# Altium schematic sheet pioneer_2-bluepill_eletronic_wrapper.SchDoc
size A; SheetNumber: 1; SheetTotal: 3
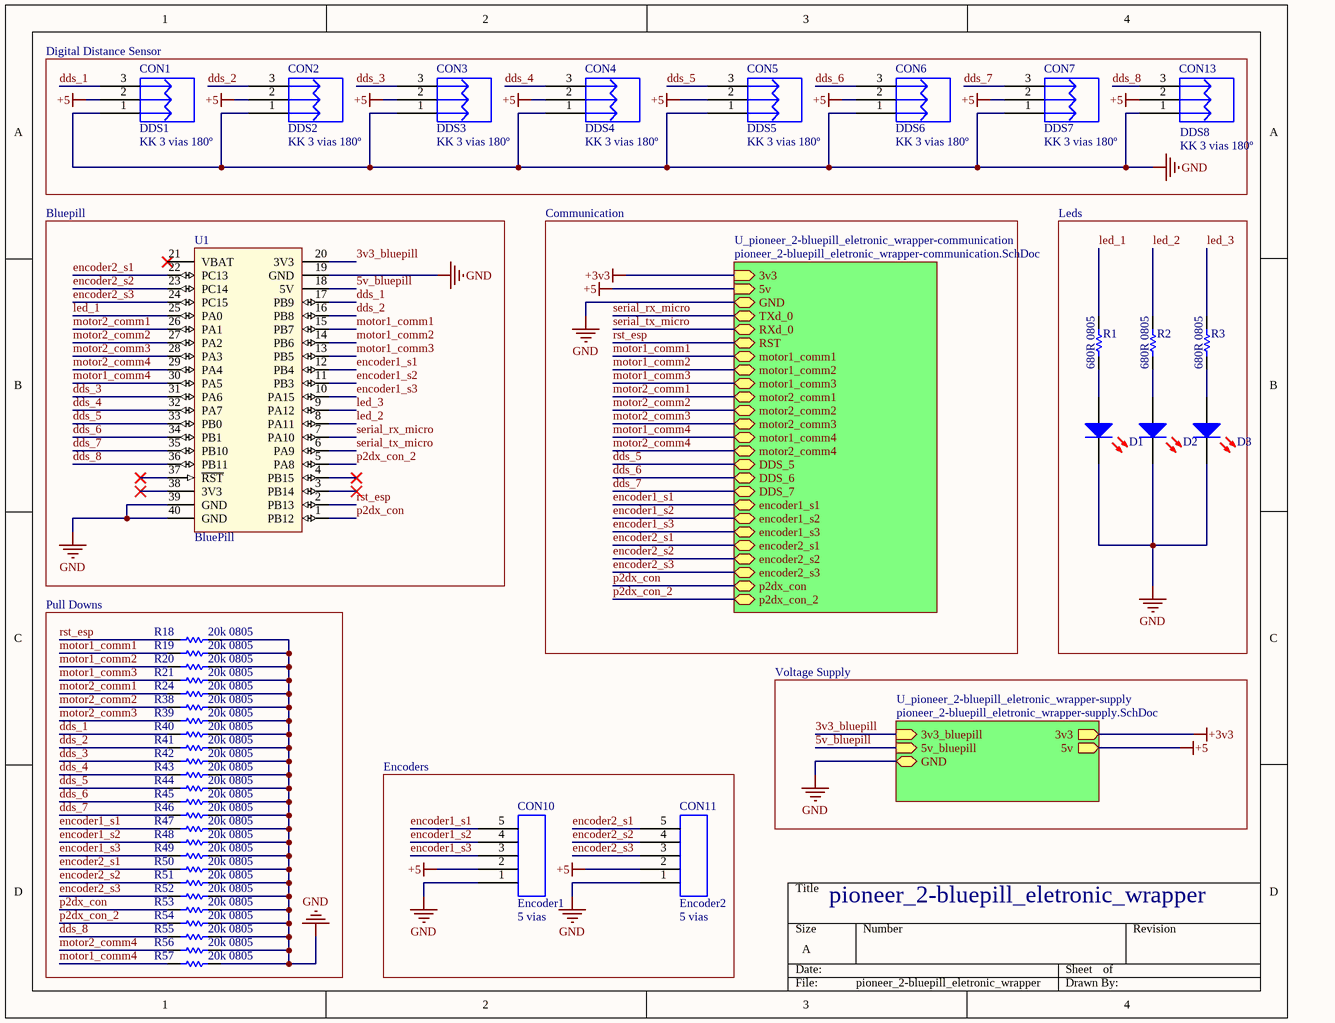
[diagram p0: pioneer_2-bluepill_eletronic_wrapper.SchDoc]

## Parts
CON1  DDS1  Valor: KK 3 vias 180º  [KK_3vias_180º]
CON2  DDS2  Valor: KK 3 vias 180º  [KK_3vias_180º]
CON3  DDS3  Valor: KK 3 vias 180º  [KK_3vias_180º]
CON4  DDS4  Valor: KK 3 vias 180º  [KK_3vias_180º]
CON5  DDS5  Valor: KK 3 vias 180º  [KK_3vias_180º]
CON6  DDS6  Valor: KK 3 vias 180º  [KK_3vias_180º]
CON7  DDS7  Valor: KK 3 vias 180º  [KK_3vias_180º]
CON10  Encoder1  Valor: 5 vias  [5vias]
CON11  Encoder2  Valor: 5 vias  [5vias]
CON13  DDS8  Valor: KK 3 vias 180º  [KK_3vias_180º]
D1  LED 3MM RED  [LED RED]  (value not drawn)
D2  LED 3MM RED  [LED RED]  (value not drawn)
D3  LED 3MM RED  [LED RED]  (value not drawn)
R1  680R 0805  [RESISTOR 0805]
R2  680R 0805  [RESISTOR 0805]
R3  680R 0805  [RESISTOR 0805]
R18  20k 0805  [RESISTOR 0805]
R19  20k 0805  [RESISTOR 0805]
R20  20k 0805  [RESISTOR 0805]
R21  20k 0805  [RESISTOR 0805]
R24  20k 0805  [RESISTOR 0805]
R38  20k 0805  [RESISTOR 0805]
R39  20k 0805  [RESISTOR 0805]
R40  20k 0805  [RESISTOR 0805]
R41  20k 0805  [RESISTOR 0805]
R42  20k 0805  [RESISTOR 0805]
R43  20k 0805  [RESISTOR 0805]
R44  20k 0805  [RESISTOR 0805]
R45  20k 0805  [RESISTOR 0805]
R46  20k 0805  [RESISTOR 0805]
R47  20k 0805  [RESISTOR 0805]
R48  20k 0805  [RESISTOR 0805]
R49  20k 0805  [RESISTOR 0805]
R50  20k 0805  [RESISTOR 0805]
R51  20k 0805  [RESISTOR 0805]
R52  20k 0805  [RESISTOR 0805]
R53  20k 0805  [RESISTOR 0805]
R54  20k 0805  [RESISTOR 0805]
R55  20k 0805  [RESISTOR 0805]
R56  20k 0805  [RESISTOR 0805]
R57  20k 0805  [RESISTOR 0805]
U1  BluePill  [BluePill]

## Blocks framed on the sheet
Digital Distance Sensor: CON1-CON7 CON13
Bluepill: U1
Leds: D1-D3 R1-R3
Pull Downs: R18-R21 R24 R38-R57
Encoders: CON10 CON11

## Sub-sheets
U_pioneer_2-bluepill_eletronic_wrapper-communication = pioneer_2-bluepill_eletronic_wrapper-communication.SchDoc: 3v3 (in), 5v (in), GND (bidir), TXd_0 (bidir), RXd_0 (bidir), RST (bidir), motor1_comm1 (bidir), motor1_comm2 (bidir), motor1_comm3 (bidir), motor2_comm1 (bidir), motor2_comm2 (bidir), motor2_comm3 (bidir), motor1_comm4 (bidir), motor2_comm4 (bidir), DDS_5 (bidir), DDS_6 (bidir), DDS_7 (bidir), encoder1_s1 (bidir), encoder1_s2 (bidir), encoder1_s3 (bidir), encoder2_s1 (bidir), encoder2_s2 (bidir), encoder2_s3 (bidir), p2dx_con (bidir), p2dx_con_2 (bidir)
U_pioneer_2-bluepill_eletronic_wrapper-supply = pioneer_2-bluepill_eletronic_wrapper-supply.SchDoc: 3v3_bluepill (in), 5v_bluepill (in), 3v3 (out), 5v (out), GND (bidir)

## Nets
+3v3: sheet U_pioneer_2-bluepill_eletronic_wrapper-supply/3v3, sheet U_pioneer_2-bluepill_eletronic_wrapper-communication/3v3
+5: CON1.2 CON2.2 CON3.2 CON4.2 CON5.2 CON6.2 CON7.2 CON10.2 CON11.2 CON13.2 ; sheet U_pioneer_2-bluepill_eletronic_wrapper-supply/5v, sheet U_pioneer_2-bluepill_eletronic_wrapper-communication/5v
GND: CON1.1 CON2.1 CON3.1 CON4.1 CON5.1 CON6.1 CON7.1 CON10.1 CON11.1 CON13.1 D1.2(K) D2.2(K) D3.2(K) R18.2 R19.2 R20.2 R21.2 R24.2 R38.2 R39.2 R40.2 R41.2 R42.2 R43.2 R44.2 R45.2 R46.2 R47.2 R48.2 R49.2 R50.2 R51.2 R52.2 R53.2 R54.2 R55.2 R56.2 R57.2 U1.19(GND) U1.39(GND) U1.40(GND) ; sheet U_pioneer_2-bluepill_eletronic_wrapper-supply/GND, sheet U_pioneer_2-bluepill_eletronic_wrapper-communication/GND
3v3_bluepill: U1.20(3V3) ; sheet U_pioneer_2-bluepill_eletronic_wrapper-supply/3v3_bluepill
5v_bluepill: U1.18(5V) ; sheet U_pioneer_2-bluepill_eletronic_wrapper-supply/5v_bluepill
dds_1: CON1.3 R40.1 U1.17(PB9)
dds_2: CON2.3 R41.1 U1.16(PB8)
dds_3: CON3.3 R42.1 U1.31(PA6)
dds_4: CON4.3 R43.1 U1.32(PA7)
dds_5: CON5.3 R44.1 U1.33(PB0) ; sheet U_pioneer_2-bluepill_eletronic_wrapper-communication/DDS_5
dds_6: CON6.3 R45.1 U1.34(PB1) ; sheet U_pioneer_2-bluepill_eletronic_wrapper-communication/DDS_6
dds_7: CON7.3 R46.1 U1.35(PB10) ; sheet U_pioneer_2-bluepill_eletronic_wrapper-communication/DDS_7
dds_8: CON13.3 R55.1 U1.36(PB11)
encoder1_s1: CON10.5 R47.1 U1.12(PB4) ; sheet U_pioneer_2-bluepill_eletronic_wrapper-communication/encoder1_s1
encoder1_s2: CON10.4 R48.1 U1.11(PB3) ; sheet U_pioneer_2-bluepill_eletronic_wrapper-communication/encoder1_s2
encoder1_s3: CON10.3 R49.1 U1.10(PA15) ; sheet U_pioneer_2-bluepill_eletronic_wrapper-communication/encoder1_s3
encoder2_s1: CON11.5 R50.1 U1.22(PC13) ; sheet U_pioneer_2-bluepill_eletronic_wrapper-communication/encoder2_s1
encoder2_s2: CON11.4 R51.1 U1.23(PC14) ; sheet U_pioneer_2-bluepill_eletronic_wrapper-communication/encoder2_s2
encoder2_s3: CON11.3 R52.1 U1.24(PC15) ; sheet U_pioneer_2-bluepill_eletronic_wrapper-communication/encoder2_s3
led_1: R1.2 U1.25(PA0)
led_2: R2.2 U1.8(PA11)
led_3: R3.2 U1.9(PA12)
motor1_comm1: R19.1 U1.15(PB7) ; sheet U_pioneer_2-bluepill_eletronic_wrapper-communication/motor1_comm1
motor1_comm2: R20.1 U1.14(PB6) ; sheet U_pioneer_2-bluepill_eletronic_wrapper-communication/motor1_comm2
motor1_comm3: R21.1 U1.13(PB5) ; sheet U_pioneer_2-bluepill_eletronic_wrapper-communication/motor1_comm3
motor1_comm4: R57.1 U1.30(PA5) ; sheet U_pioneer_2-bluepill_eletronic_wrapper-communication/motor1_comm4
motor2_comm1: R24.1 U1.26(PA1) ; sheet U_pioneer_2-bluepill_eletronic_wrapper-communication/motor2_comm1
motor2_comm2: R38.1 U1.27(PA2) ; sheet U_pioneer_2-bluepill_eletronic_wrapper-communication/motor2_comm2
motor2_comm3: R39.1 U1.28(PA3) ; sheet U_pioneer_2-bluepill_eletronic_wrapper-communication/motor2_comm3
motor2_comm4: R56.1 U1.29(PA4) ; sheet U_pioneer_2-bluepill_eletronic_wrapper-communication/motor2_comm4
p2dx_con: R53.1 U1.1(PB12) ; sheet U_pioneer_2-bluepill_eletronic_wrapper-communication/p2dx_con
p2dx_con_2: R54.1 U1.5(PA8) ; sheet U_pioneer_2-bluepill_eletronic_wrapper-communication/p2dx_con_2
rst_esp: R18.1 U1.2(PB13) ; sheet U_pioneer_2-bluepill_eletronic_wrapper-communication/RST
serial_rx_micro: U1.7(PA10) ; sheet U_pioneer_2-bluepill_eletronic_wrapper-communication/TXd_0
serial_tx_micro: U1.6(PA9) ; sheet U_pioneer_2-bluepill_eletronic_wrapper-communication/RXd_0
NetD1_1: D1.1(A) R1.1
NetD2_1: D2.1(A) R2.1
NetD3_1: D3.1(A) R3.1

Not connected (* = marked no-connect by the designer): U1 3(PB14)* 4(PB15)* 21(VBAT)* 37(~{RST})* 38(3V3)*

## Notes on the sheet
- Communication
- Voltage Supply
- pioneer_2-bluepill_eletronic_wrapper

## Library data of the parts
CON1-CON7 CON13 = KK_2.54_3vias: Conector KK 2.54mm 3 vias; Descrição: Conector KK 3 vias com passo 2.54mm; Encapsulamento: PTH - 180º; Modelo: 3 vias - 180º; Marca: *; Observação: *
CON10 CON11 = 2.54_5vias: holes 2.54mm 5 vias; Descrição: Conector KK 3 vias com passo 2.54mm; Encapsulamento: PTH - 180º; Modelo: 3 vias - 180º; Marca: *; Observação: *
D1-D3 = LED 3MM RED: Manufacturer: Paralight; Manufacturer Part Number: IMP585; Wavelength Typ: 625; Forward Voltage: 2; Forward Current If: 20; Luminous Intensity: 3; LED Mounting: Through Hole; Lens Shape: Round; Viewing Angle: 60°; SVHC: No SVHC (15-Jun-2015); External Diameter: 2.9; External Length / Height: 4.6; Forward Voltage VF Max: 2.5; LED / Lamp Size: 3mm / T-1; LED Type: Standard; Lead Cross-section Depth: 0.5; Luminous Intensity @ If Min: 0.7; PIV Max: 5; Peak Forward Current: 7; Voltage Vf Typ: 2.2V<!--FANDB--><div class="features-and-benefits-container"><div class="features-and-benefits-description"><span class="features-benefits-value">The L-934LID from Kingbright is a through hole round shape high efficiency red colour LED. The device is made of gallium arsenide phosphide on gallium phosphide orange light emitting diode. This LED is widely used because of low power consumption, long life and solid state reliability.</span></div><div class="features-and-benefits-list"><ul class="features-and-benefits-list-list"><li class="features-and-benefits-list-item">Standard bulb size of T-1 (3mm)</li><li class="features-and-benefits-list-item">Reliable and rugged</li><li class="features-and-benefits-list-item">Viewing angle is 60°</li><li class="features-and-benefits-list-item">Luminous intensity of 3mcd at 2mA</li><li class="features-and-benefits-list-item">Forward voltage is 2.0V</li><li class="features-and-benefits-list-item">Forward current (If) is 20mA</li><li class="features-and-benefits-list-item">Dominant wavelength is 625nm at IF=20mA</li><li class="features-and-benefits-list-item">Peak wavelength is 627nm at IF=20; Supplier 1: Mult Comercial; RoHS: YES; Stock 1: 35260; Pricing 1: 1=0.15 (BRL); LED Colour: Red; Bulb Size: 3mm; Packaging: Each; MSL: -; Current If Luminous Intensity: 2; Dominant Wavelength: 625; Forward Current If Max: 20; Lead Cross-section Width: 0.5; Lead Spacing: 2.54; Luminous Intensity Typ: 3; Mounting Type: PCB Through Hole; No. of Pins: 2; Operating Temperature Max: 85; Operating Temperature Min: -40; Operating Temperature Range: -40°C to +85; Peak Wavelength: 625; ComponentLink1URL: http://loja.multcomercial.com.br/led-3mm-vermelho-difuso-l-314hd-paralight.html; ComponentLink1Description: http://loja.multcomercial.com.br/led-3mm-vermelho-difuso-l-314hd-paralight.html; Supplier Part Number 1: Led 3mm Vermelho Difuso L-314HD - Paralight
R1-R3 R18-R21 R24 R38-R57 = RES 0805 5%: 0805; Manufacturer: PANASONIC ELECTRONIC COMPONENTS; Manufacturer Part Number: ERJ-3GEY0R00V; Product Range: AEC-Q200 ERJ3; Resistance: 0; Power Rating: 100; Voltage Rating: 75; Resistor Case Style: 0603 [1608 Metric]; Resistance (Ohms): 0.0; Tolerance: Jumper; Power (Watts): 0.1W, 1/10W; Brand: Panasonic; Qualification: AEC-Q200; RoHS: YES; Resistance Tolerance: -; Packaging: Cut Tape; MSL: -; ComponentLink1URL: http://www.farnell.com/cad/1697908.zip; ComponentLink1Description: http://www.farnell.com/cad/1697908.zip; ComponentLink2URL: http://www.farnell.com/datasheets/1678796.pdf; ComponentLink2Description: http://www.farnell.com/datasheets/1678796.pdf; Category: Resistors; Composition: Thick Film; Features: Automotive AEC-Q200; Temperature Coefficient: -; Operating Temperature: -55°C ~ 155°C; Package / Case: 0603 (1608 Metric); Supplier Device Package: 0603; Size / Dimension: 0.063" L x 0.031" W (1.60mm x 0.80mm); Height: 0.022" (0.55mm); Number of Terminations: 2; ComponentLink3URL: http://industrial.panasonic.com/www-cgi/jvcr13pz.cgi?E+PZ+3+AOA0001+ERJ3GEY0R00V+7+WW; ComponentLink3Description: http://industrial.panasonic.com/www-cgi/jvcr13pz.cgi?E+PZ+3+AOA0001+ERJ3GEY0R00V+7+WW; Supplier 1: Mouser; Stock 1: 1987085; Pricing 1: 1=0.160, 10=0.019, 100=0.013, 500=0.010, 1000=0.005, 5000=0.003 (AUD); Length: 1.6 mm; Operating Temperature Range: - 55 C to + 155 C; Product: Thick Film Resistors Zero-Ohm; Series: ERJ; Termination Style: SMD/SMT; Type: Thick Film Resistors SMD; Width: 0.8 mm; Case Code - in: 0603; Case Code - mm: 1608; RoHS - Mouser: E; Minimum Order Quantity: 1; Reeling: True; ComponentLink4URL: http://www.mouser.com/ds/2/315/AOA0000C84-947596.pdf; ComponentLink4Description: http://www.mouser.com/ds/2/315/AOA0000C84-947596.pdf; Supplier Part Number 1: 667-ERJ-3GEY0R00V
U1 = CMP-010-000000-1: BluePill - STMDuino (STM32F103); Source: uControlador.SchLib; Design Item ID: BluePill; Component Type: Interface